# Altium schematic sheet UD3.1 Bootstrap Gate Driver.SchDoc
size A4; DocumentNumber: 6; SheetNumber: 6; SheetTotal: 7
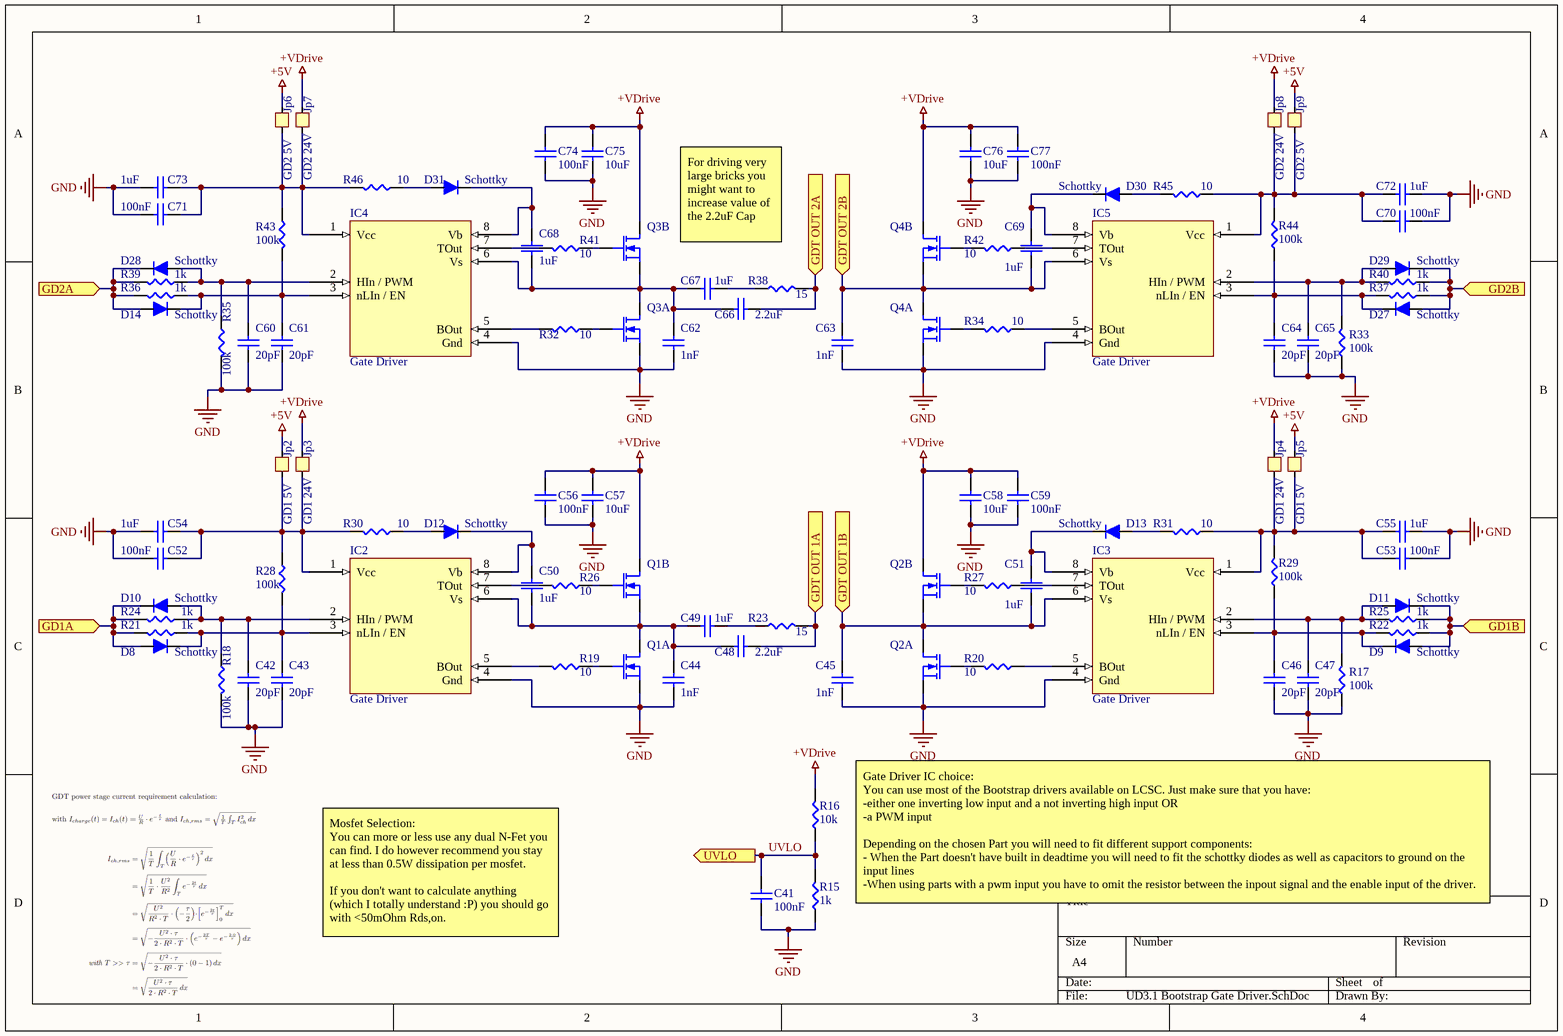
[diagram p0: UD3.1 Bootstrap Gate Driver.SchDoc]

## Parts
C41  100nF  [0603]
C42  20pF  [0603]
C43  20pF  [0603]
C44  1nF  [0805]
C45  1nF  [0805]
C46  20pF  [0603]
C47  20pF  [0603]
C48  2.2uF  [1206]
C49  1uF  [1206]
C50  1uF  [0805]
C51  1uF  [0805]
C52  100nF  [0603]
C53  100nF  [0603]
C54  1uF  [0805]
C55  1uF  [0805]
C56  100nF  [0603]
C57  10uF  [0805]
C58  10uF  [0805]
C59  100nF  [0603]
C60  20pF  [0603]
C61  20pF  [0603]
C62  1nF  [0805]
C63  1nF  [0805]
C64  20pF  [0603]
C65  20pF  [0603]
C66  2.2uF  [1206]
C67  1uF  [1206]
C68  1uF  [0805]
C69  1uF  [0805]
C70  100nF  [0805]
C71  100nF  [0805]
C72  1uF  [0805]
C73  1uF  [0805]
C74  100nF  [0805]
C75  10uF  [0805]
C76  10uF  [0805]
C77  100nF  [0805]
D8  Schottky  [SOD523]
D9  Schottky  [SOD523]
D10  Schottky  [SOD523]
D11  Schottky  [SOD523]
D12  Schottky  [SOD523]
D13  Schottky  [SOD523]
D14  Schottky  [SOD523]
D27  Schottky  [SOD523]
D28  Schottky  [SOD523]
D29  Schottky  [SOD523]
D30  Schottky  [SOD523]
D31  Schottky  [SOD523]
IC2  Gate Driver  [SOIC8]
IC3  Gate Driver  [SOIC8]
IC4  Gate Driver  [SOIC8]
IC5  Gate Driver  [SOIC8]
Jp2  GD1 5V  [PCB Jumper NO]
Jp3  GD1 24V  [PCB Jumper NO]
Jp4  GD1 24V  [PCB Jumper NO]
Jp5  GD1 5V  [PCB Jumper NO]
Jp6  GD2 5V  [PCB Jumper NO]
Jp7  GD2 24V  [PCB Jumper NO]
Jp8  GD2 24V  [PCB Jumper NO]
Jp9  GD2 5V  [PCB Jumper NO]
Q1  Dual NFet  [SO-8FL - Dual]  (value not drawn)  (parts A,B of 2)
Q2  Dual NFet  [SO-8FL - Dual]  (value not drawn)  (parts A,B of 2)
Q3  Dual NFet  [SO-8FL - Dual]  (value not drawn)  (parts A,B of 2)
Q4  Dual NFet  [SO-8FL - Dual]  (value not drawn)  (parts A,B of 2)
R15  1k  [0603]
R16  10k  [0603]
R17  100k  [0603]
R18  100k  [0603]
R19  10  [0805]
R20  10  [0805]
R21  1k  [0603]
R22  1k  [0603]
R23  15  [1206]
R24  1k  [0603]
R25  1k  [0603]
R26  10  [0805]
R27  10  [0805]
R28  100k  [0603]
R29  100k  [0603]
R30  10  [0603]
R31  10  [0603]
R32  10  [0805]
R33  100k  [0603]
R34  10  [0805]
R35  100k  [0603]
R36  1k  [0603]
R37  1k  [0603]
R38  15  [1206]
R39  1k  [0603]
R40  1k  [0603]
R41  10  [0805]
R42  10  [0805]
R43  100k  [0603]
R44  100k  [0603]
R45  10  [0603]
R46  10  [0603]

## Ports
GD1A (in), GD1B (in), GD2A (in), GD2B (in), GDT OUT 1A (in), GDT OUT 1B (in), GDT OUT 2A (in), GDT OUT 2B (in), UVLO (out)

## Nets
+5V: Jp2.2 Jp5.2 Jp6.2 Jp9.2
+VDrive: C56.2 C57.2 C58.2 C59.2 C74.2 C75.2 C76.2 C77.2 Jp3.2 Jp4.2 Jp7.2 Jp8.2 Q1.D1 Q2.D1 Q3.D1 Q4.D1 R16.1
GND: C41.1 C42.2 C43.2 C44.1 C45.1 C46.2 C47.2 C52.2 C53.2 C54.2 C55.2 C56.1 C57.1 C58.1 C59.1 C60.2 C61.2 C62.1 C63.1 C64.2 C65.2 C70.2 C71.2 C72.2 C73.2 C74.1 C75.1 C76.1 C77.1 IC2.4(Gnd) IC3.4(Gnd) IC4.4(Gnd) IC5.4(Gnd) Q1.S2 Q2.S2 Q3.S2 Q4.S2 R15.2 R17.1 R18.1 R33.1 R35.1
GD1A: D8.1 D10.2 R21.1 R24.1 ; port GD1A
GD1B: D9.1 D11.2 R22.1 R25.1 ; port GD1B
GD2A: D14.1 D28.2 R36.1 R39.1 ; port GD2A
GD2B: D27.1 D29.2 R37.1 R40.1 ; port GD2B
GDT OUT 1A: C48.2 R23.2 ; port GDT OUT 1A
GDT OUT 1B: C45.2 C51.1 IC3.6(Vs) Q2.D2 Q2.S1 ; port GDT OUT 1B
GDT OUT 2A: C66.2 R38.2 ; port GDT OUT 2A
GDT OUT 2B: C63.2 C69.1 IC5.6(Vs) Q4.D2 Q4.S1 ; port GDT OUT 2B
UVLO: C41.2 R15.1 R16.2 ; port UVLO
NetC42_1: C42.1 D10.1 IC2.2(HIn_/_PWM) R18.2 R24.2
NetC43_1: C43.1 D8.2 IC2.3(nLIn_/_EN) R21.2 R28.1
NetC44_2: C44.2 C48.1 C49.1 C50.1 IC2.6(Vs) Q1.D2 Q1.S1
NetC46_1: C46.1 D9.2 IC3.3(nLIn_/_EN) R22.2 R29.1
NetC47_1: C47.1 D11.1 IC3.2(HIn_/_PWM) R17.2 R25.2
NetC49_2: C49.2 R23.1
NetC50_2: C50.2 D12.2 IC2.8(Vb)
NetC51_2: C51.2 D13.2 IC3.8(Vb)
NetC52_1: C52.1 C54.1 IC2.1(Vcc) Jp2.1 Jp3.1 R28.2 R30.1
NetC53_1: C53.1 C55.1 IC3.1(Vcc) Jp4.1 Jp5.1 R29.2 R31.1
NetC60_1: C60.1 D28.1 IC4.2(HIn_/_PWM) R35.2 R39.2
NetC61_1: C61.1 D14.2 IC4.3(nLIn_/_EN) R36.2 R43.1
NetC62_2: C62.2 C66.1 C67.1 C68.1 IC4.6(Vs) Q3.D2 Q3.S1
NetC64_1: C64.1 D27.2 IC5.3(nLIn_/_EN) R37.2 R44.1
NetC65_1: C65.1 D29.1 IC5.2(HIn_/_PWM) R33.2 R40.2
NetC67_2: C67.2 R38.1
NetC68_2: C68.2 D31.2 IC4.8(Vb)
NetC69_2: C69.2 D30.2 IC5.8(Vb)
NetC70_1: C70.1 C72.1 IC5.1(Vcc) Jp8.1 Jp9.1 R44.2 R45.1
NetC71_1: C71.1 C73.1 IC4.1(Vcc) Jp6.1 Jp7.1 R43.2 R46.1
NetD12_1: D12.1 R30.2
NetD13_1: D13.1 R31.2
NetD30_1: D30.1 R45.2
NetD31_1: D31.1 R46.2
NetIC2_5: IC2.5(BOut) R19.1
NetIC2_7: IC2.7(TOut) R26.1
NetIC3_5: IC3.5(BOut) R20.1
NetIC3_7: IC3.7(TOut) R27.1
NetIC4_5: IC4.5(BOut) R32.1
NetIC4_7: IC4.7(TOut) R41.1
NetIC5_5: IC5.5(BOut) R34.1
NetIC5_7: IC5.7(TOut) R42.1
NetQ1_G1: Q1.G1 R26.2
NetQ1_G2: Q1.G2 R19.2
NetQ2_G1: Q2.G1 R27.2
NetQ2_G2: Q2.G2 R20.2
NetQ3_G1: Q3.G1 R41.2
NetQ3_G2: Q3.G2 R32.2
NetQ4_G1: Q4.G1 R42.2
NetQ4_G2: Q4.G2 R34.2

## Notes on the sheet
- For driving very large bricks you might want to increase value of the 2.2uF Cap
- Gate Driver IC choice:
  You can use most of the Bootstrap drivers available on LCSC. Just make sure that you have:
  -either one inverting low input and a not inverting high input OR
  -a PWM input
  Depending on the chosen Part you will need to fit different support components:
  - When the Part doesn't have built in deadtime you will need to fit the schottky diodes as well as capacitors to ground on the input lines
  -When using parts with a pwm input you have to omit the resistor between the inpout signal and the enable input of the driver.
- Mosfet Selection:
  You can more or less use any dual N-Fet you can find. I do however recommend you stay at less than 0.5W dissipation per mosfet.
  If you don't want to calculate anything (which I totally understand :P) you should go with <50mOhm Rds,on.

## Library data of the parts
C41-C77 = Cap
  C42 C43 C46 C47 C52-C55 C60 C61 C64 C65 C70-C73: Supplier 1: Digi-Key; Supplier 2: Digi-Key; Supplier 3: Digi-Key; Supplier Part Number 1: 1276-2044-1-ND; Supplier Part Number 2: 1276-1018-1-ND; Supplier Part Number 3: 1276-1182-1-ND; Supplier 4: Digi-Key; Supplier 5: Digi-Key; Supplier 6: Digi-Key; Supplier 7: Digi-Key; Supplier 8: Digi-Key; Supplier 9: Digi-Key; Supplier Part Number 4: 1276-1009-1-ND; Supplier Part Number 5: 1276-1098-1-ND; Supplier Part Number 6: 1276-1119-1-ND; Supplier Part Number 7: 490-12737-1-ND; Supplier Part Number 9: 587-1249-1-ND; Supplier Part Number 8: 1276-1183-1-ND; Supplier 10: Digi-Key; Supplier 11: Digi-Key; Supplier 12: Digi-Key; Supplier 13: Digi-Key; Supplier Part Number 10: 1276-CL10B104KB8NNNLCT-ND; Supplier Part Number 11: 399-1085-1-ND; Supplier Part Number 13: 587-2985-1-ND; Supplier Part Number 12: 1276-1021-1-ND; Supplier 14: Digi-Key; Supplier 15: Digi-Key; Supplier 16: Digi-Key; Supplier 17: Digi-Key; Supplier 18: Digi-Key; Supplier 19: Digi-Key; Supplier Part Number 14: 490-14603-1-ND; Supplier Part Number 15: 311-3700-1-ND; Supplier Part Number 16: 311-1042-1-ND; Supplier Part Number 17: 311-1415-1-ND; Supplier Part Number 19: 587-4321-1-ND; Supplier Part Number 18: 1276-1907-1-ND; Supplier 20: Digi-Key; Supplier 21: Digi-Key; Supplier 22: Digi-Key; Supplier Part Number 20: 1276-6767-1-ND; Supplier Part Number 21: 1276-7060-1-ND; Supplier Part Number 22: 311-1084-1-ND
D8-D14 D27-D31 = Diode: Cmon its a diode what more do I need to say?; pin to pad: 1>2 2>1; Supplier 1: Digi-Key; Supplier Part Number 1: MBR10100GOS-ND; Supplier 2: Digi-Key; Supplier Part Number 2: 1655-1504-1-ND
IC2-IC5 = Gatedriver Bootstrap: Bootstrappable half bridge driver IC
Jp2-Jp9 = Jumper
Q1-Q4 = Mosfet 2N: Dual Mosfet, two N channel; pin to pad: D1>7/8 D2>5/6 G1>2 G2>4 S1>1 S2>3; Supplier 1: Digi-Key
R15-R46 = Resistor